# EAGLE schematic Adafruit NeoPixel Ring 12 (EAGLE 9.4.2)
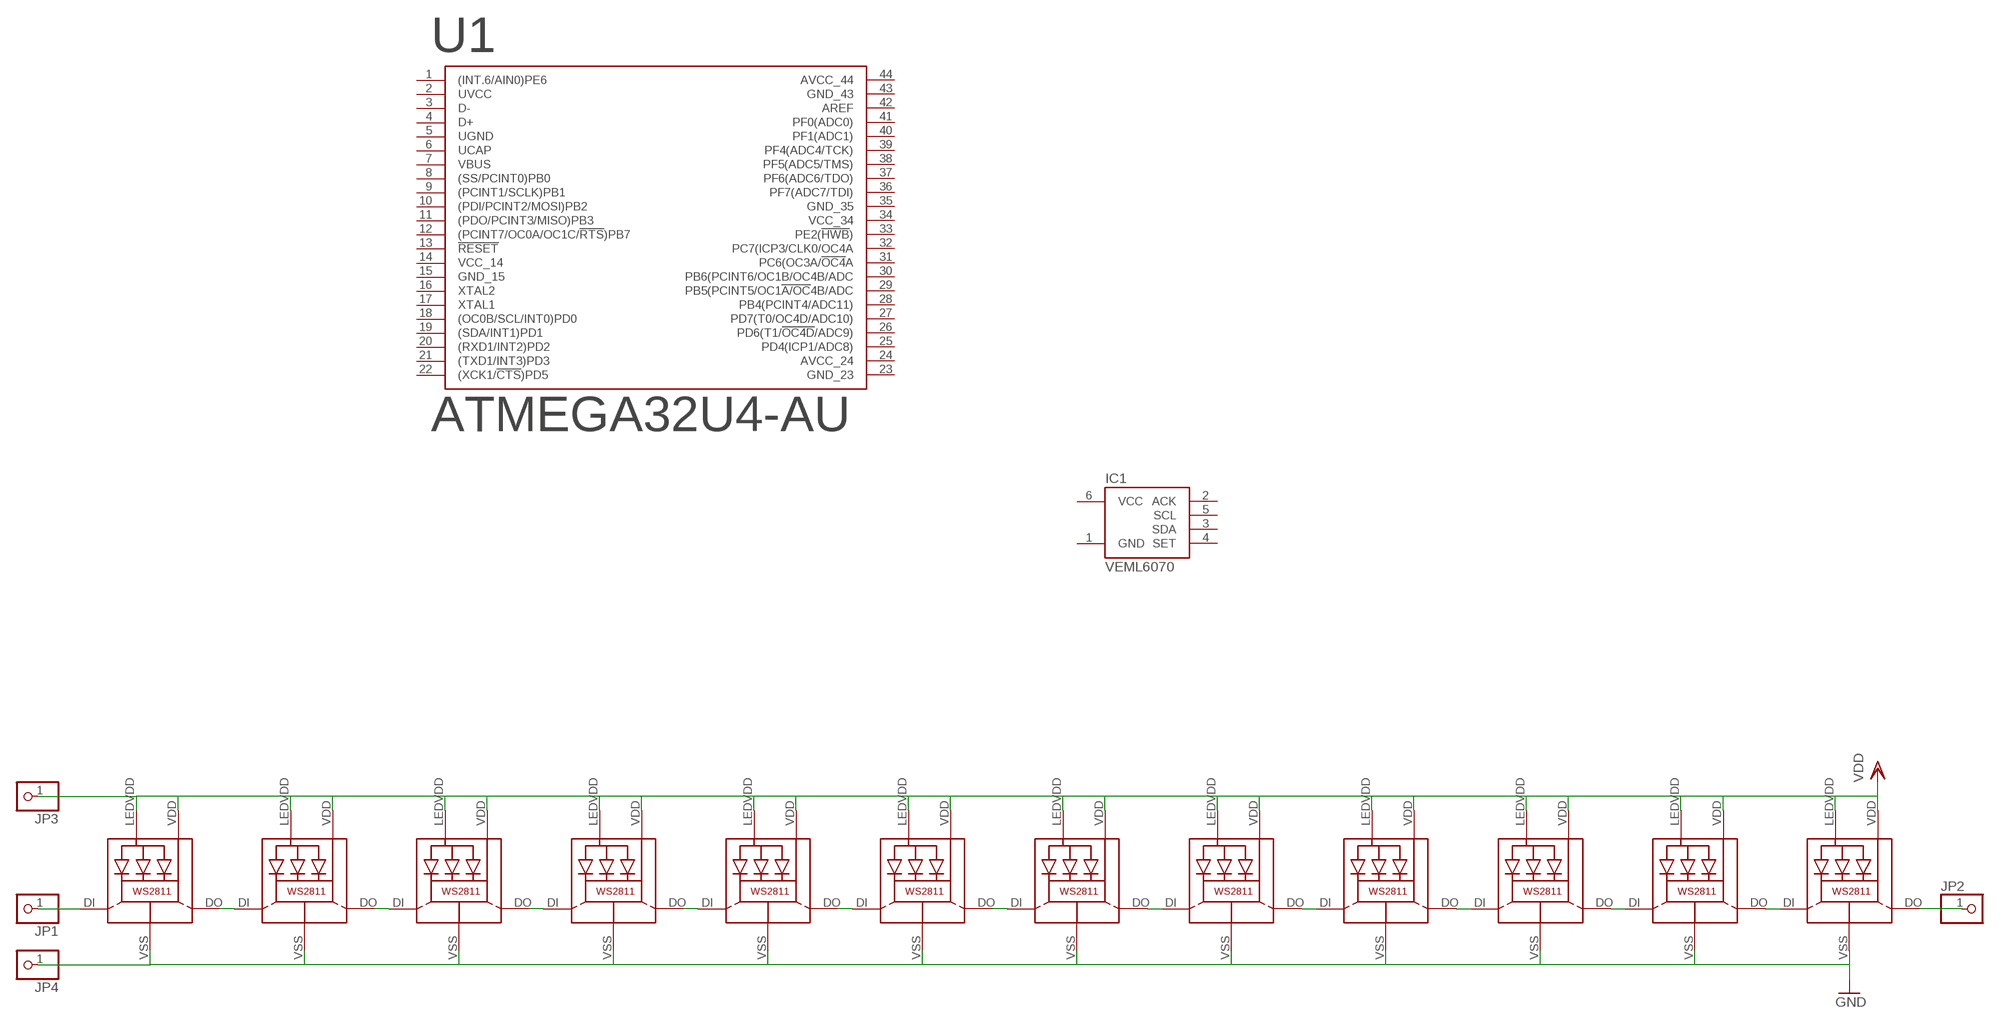
[diagram p0: schematic, sheet 1]

## Parts
IC1  VEML6070  [OPLGA]
JP1  PINHD-1X1CB  [1X01-CLEANBIG]
JP2  PINHD-1X1CB  [1X01-CLEANBIG]
JP3  PINHD-1X1CB  [1X01-CLEANBIG]
JP4  PINHD-1X1CB  [1X01-CLEANBIG]
LED1  WS28115050  [WS28115050]
LED2  WS28115050  [WS28115050]
LED3  WS28115050  [WS28115050]
LED4  WS28115050  [WS28115050]
LED5  WS28115050  [WS28115050]
LED6  WS28115050  [WS28115050]
LED7  WS28115050  [WS28115050]
LED8  WS28115050  [WS28115050]
LED9  WS28115050  [WS28115050]
LED10  WS28115050  [WS28115050]
LED11  WS28115050  [WS28115050]
LED12  WS28115050  [WS28115050]
U1  ATMEGA32U4-AU  [44-TQFP]

## Nets
GND: JP4.1 LED1.VSS(GND) LED2.VSS(GND) LED3.VSS(GND) LED4.VSS(GND) LED5.VSS(GND) LED6.VSS(GND) LED7.VSS(GND) LED8.VSS(GND) LED9.VSS(GND) LED10.VSS(GND) LED11.VSS(GND) LED12.VSS(GND)
N$1: LED1.DO LED2.DI
N$2: LED2.DO LED3.DI
N$3: LED3.DO LED4.DI
N$4: LED4.DO LED5.DI
N$5: LED5.DO LED6.DI
N$6: LED6.DO LED7.DI
N$7: LED7.DO LED8.DI
N$8: LED8.DO LED9.DI
N$9: LED9.DO LED10.DI
N$10: LED10.DO LED11.DI
N$11: LED11.DO LED12.DI
N$13: JP1.1 LED1.DI
N$14: JP2.1 LED12.DO
VDD: JP3.1 LED1.LEDVDD LED1.VDD LED2.LEDVDD LED2.VDD LED3.LEDVDD LED3.VDD LED4.LEDVDD LED4.VDD LED5.LEDVDD LED5.VDD LED6.LEDVDD LED6.VDD LED7.LEDVDD LED7.VDD LED8.LEDVDD LED8.VDD LED9.LEDVDD LED9.VDD LED10.LEDVDD LED10.VDD LED11.LEDVDD LED11.VDD LED12.LEDVDD LED12.VDD
Unconnected: IC1.2(ACK) IC1.3(SDA) IC1.4(SET) IC1.5(SCL) U1.1((INT.6/AIN0)PE6) U1.3(D-) U1.4(D+) U1.7(VBUS) U1.8((SS/PCINT0)PB0) U1.9((PCINT1/SCLK)PB1) U1.10((PDI/PCINT2/MOSI)PB2) U1.11((PDO/PCINT3/MISO)PB3) U1.12((PCINT7/OC0A/OC1C/!RTS!)PB7) U1.13(!RESET) U1.16(XTAL2) U1.17(XTAL1) U1.18((OC0B/SCL/INT0)PD0) U1.19((SDA/INT1)PD1) U1.20((RXD1/INT2)PD2) U1.21((TXD1/INT3)PD3) U1.22((XCK1/!CTS!)PD5) U1.25(PD4(ICP1/ADC8)) U1.26(PD6(T1/!OC4D!/ADC9)) U1.27(PD7(T0/OC4D/ADC10)) U1.28(PB4(PCINT4/ADC11)) U1.29(PB5(PCINT5/OC1!A/OC!4B/ADC) U1.30(PB6(PCINT6/OC1B/OC4B/ADC) U1.31(PC6(OC3A/!OC4!A) U1.32(PC7(ICP3/CLK0/OC4A) U1.33(PE2(!HWB!)) U1.36(PF7(ADC7/TDI)) U1.37(PF6(ADC6/TDO)) U1.38(PF5(ADC5/TMS)) U1.39(PF4(ADC4/TCK)) U1.40(PF1(ADC1)) U1.41(PF0(ADC0)) U1.42(AREF)

## Power pins joined to a net without a drawn wire
AVCC_24: U1.24(AVCC_24)
AVCC_44: U1.44(AVCC_44)
GND: IC1.1(GND)
GND_15: U1.15(GND_15)
GND_23: U1.23(GND_23)
GND_35: U1.35(GND_35)
GND_43: U1.43(GND_43)
UCAP: U1.6(UCAP)
UGND: U1.5(UGND)
UVCC: U1.2(UVCC)
VCC: IC1.6(VCC)
VCC_14: U1.14(VCC_14)
VCC_34: U1.34(VCC_34)

## Library data of the parts
IC1 = we-sensor:VEML6070: Vishay VEML6070 UV Light Sensor (I2C)
JP1-JP4 = NeoPixelRing:PINHD-1X1: Pin header 1x1 for 0.1" spacing With round pins
LED1-LED12 = microbuilder:WS28115050
U1 = Microcontroller:ATMEGA32U4-AU: IC MCU 8BIT 32KB FLASH 44TQFP Manufacturer's datasheet <http://ww1.microchip.com/downloads/en/DeviceDoc/Atmel-7766-8-bit-AVR-ATmega16U4-32U4_Summary.pdf>; CREATED_BY: PCBLayout.com; DIGIKEY_PART_NUMBER: ATMEGA32U4-AU-ND; MANUFACTURER: Microchip Technology; MPN: ATMEGA32U4-AU; PACKAGE: 44-TQFP